# Altium project simple-VCA.PrjPcb
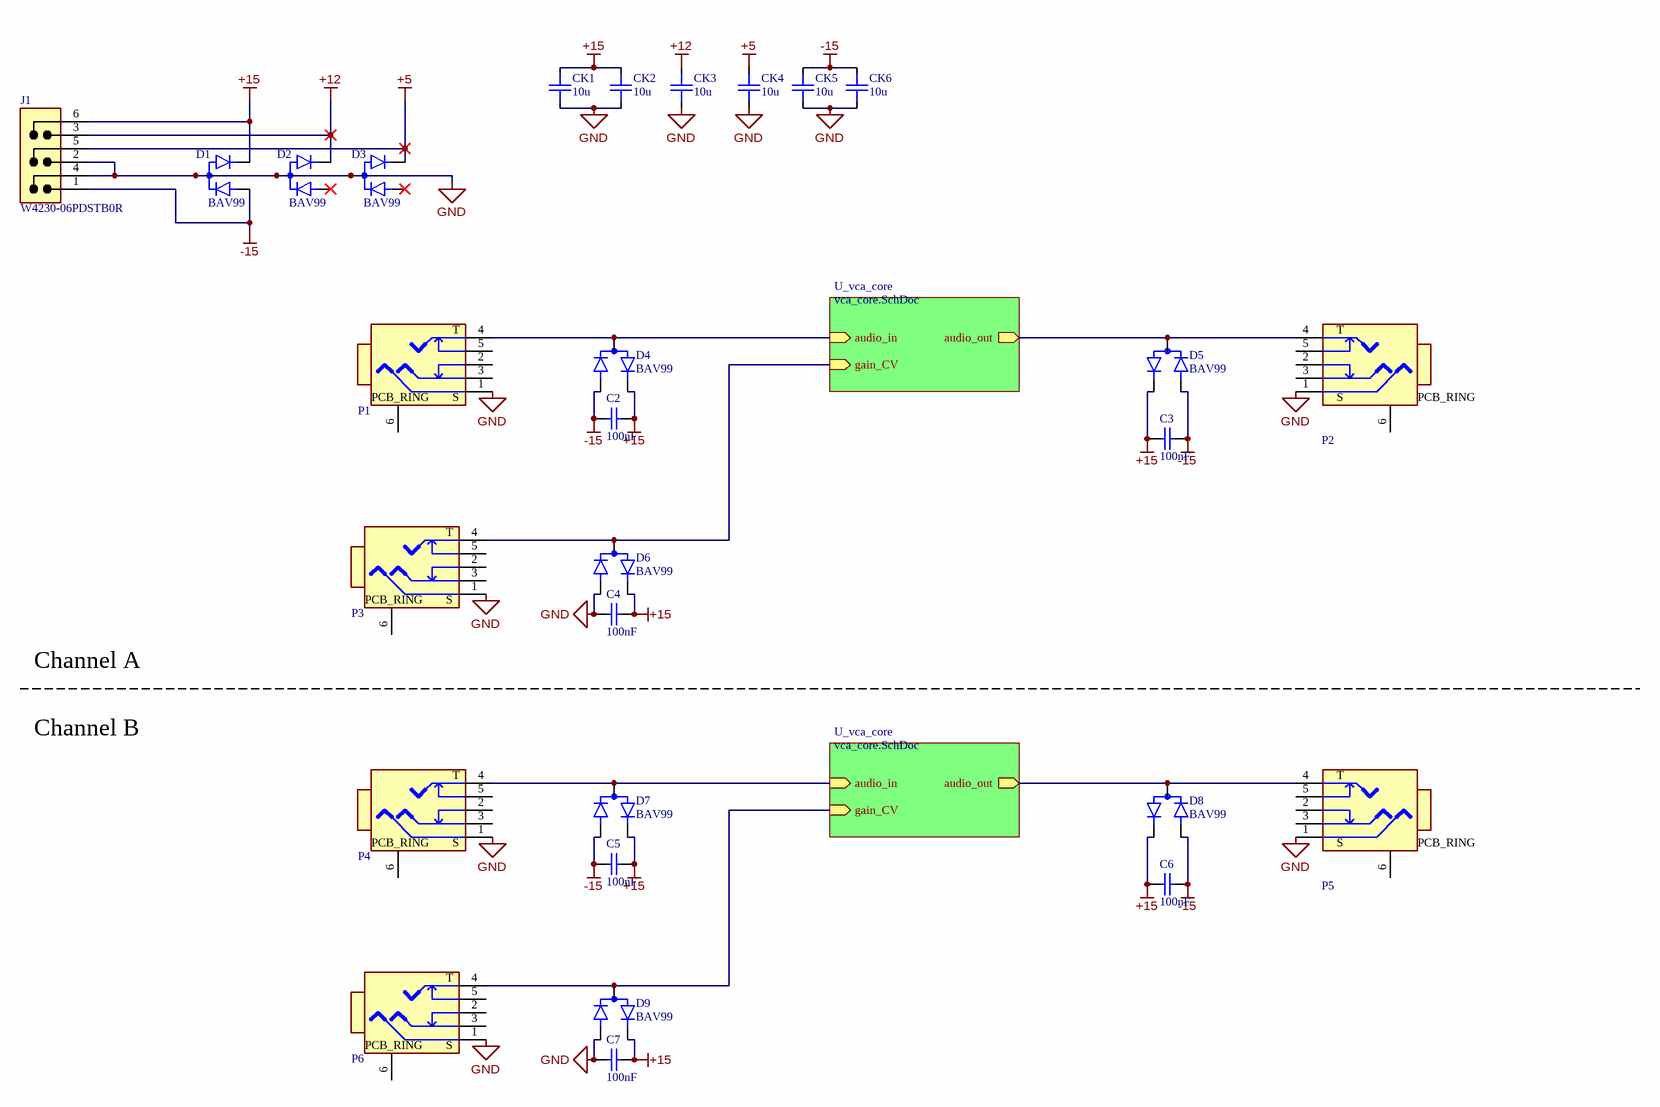
[diagram p0: main.SchDoc]
2 sheets, 98 parts. Net scope: hierarchical (ports join the sheet entries above them; power ports are global).
Board file: simple-VCA.PcbDoc
Sheets:
  main.SchDoc
    U_vca_core = vca_core.SchDoc
    U_vca_core = vca_core.SchDoc

## Sheet main.SchDoc
size A3; Organization: Medical Technologies CZ a.s.; SheetNumber: 1; SheetTotal: 2; Version1: N/A; Version2: N/A; Version3: N/A; Change1description: N/A; Change2description: N/A; Change3description: N/A; Change1DrawnBy: N/A; Change2DrawnBy: N/A; Change3DrawnBy: N/A; Change1CheckedBy: N/A; Change2CheckedBy: N/A; Change3CheckedBy: N/A; PreviusVersion_Chng1: N/A; PreviusVersion_Chng2: N/A; PreviusVersion_Chng3: N/A; Variant1description: Standard assembly; Variant2description: N/A; Variant3description: N/A; Variant4description: N/A; PrimaryCard1: XXXxxxXXX; PrimaryCard2: N/A; PrimaryCard3: N/A; PrimaryCard4: N/A; DocumentName: Docname

### Parts
C2  100nF  [WCAP-CSGP_0603_L1.6W0.8H0.8_Reflow]
C3  100nF  [WCAP-CSGP_0603_L1.6W0.8H0.8_Reflow]
C4  100nF  [WCAP-CSGP_0603_L1.6W0.8H0.8_Reflow]
C5  100nF  [WCAP-CSGP_0603_L1.6W0.8H0.8_Reflow]
C6  100nF  [WCAP-CSGP_0603_L1.6W0.8H0.8_Reflow]
C7  100nF  [WCAP-CSGP_0603_L1.6W0.8H0.8_Reflow]
CK1  10u  [CAPC3225X27N(SMC1210)]
CK2  10u  [CAPC3225X27N(SMC1210)]
CK3  10u  [CAPC3225X27N(SMC1210)]
CK4  10u  [CAPC3225X27N(SMC1210)]
CK5  10u  [CAPC3225X27N(SMC1210)]
CK6  10u  [CAPC3225X27N(SMC1210)]
D1  BAV99  [SOT95P230X110-3N(SOT23)]
D2  BAV99  [SOT95P230X110-3N(SOT23)]
D3  BAV99  [SOT95P230X110-3N(SOT23)]
D4  BAV99  [SOT95P230X110-3N(SOT23)]
D5  BAV99  [SOT95P230X110-3N(SOT23)]
D6  BAV99  [SOT95P230X110-3N(SOT23)]
D7  BAV99  [SOT95P230X110-3N(SOT23)]
D8  BAV99  [SOT95P230X110-3N(SOT23)]
D9  BAV99  [SOT95P230X110-3N(SOT23)]
J1  W4230-06PDSTB0R  [W4230-06PDS]
P1  NYS232  [NYS232]  (value not drawn)
P2  NYS232  [NYS232]  (value not drawn)
P3  NYS232  [NYS232]  (value not drawn)
P4  NYS232  [NYS232]  (value not drawn)
P5  NYS232  [NYS232]  (value not drawn)
P6  NYS232  [NYS232]  (value not drawn)

### Sub-sheets
U_vca_core = vca_core.SchDoc: audio_in (in), gain_CV (in), audio_out (out)
U_vca_core = vca_core.SchDoc: audio_in (in), gain_CV (in), audio_out (out)

### Nets
+5: CK4.1 D3.2(C2) J1.5
+12: CK3.1 D2.2(C2) J1.3
+15: C2.2 C3.2 C4.2 C5.2 C6.2 C7.2 CK1.1 CK2.1 D1.2(C2) D4.2(C2) D5.2(C2) D6.2(C2) D7.2(C2) D8.2(C2) D9.2(C2) J1.6
-15: C2.1 C3.1 C5.1 C6.1 CK5.1 CK6.1 D1.1(A1) D4.1(A1) D5.1(A1) D7.1(A1) D8.1(A1) J1.1
GND: C4.1 C7.1 CK1.2 CK2.2 CK3.2 CK4.2 CK5.2 CK6.2 D1.3(C1A2) D2.3(C1A2) D3.3(C1A2) D6.1(A1) D9.1(A1) J1.2 J1.4 P1.1(S) P2.1(S) P3.1(S) P4.1(S) P5.1(S) P6.1(S)
NetD4_3: D4.3(C1A2) P1.4(TN) ; sheet U_vca_core/audio_in
NetD5_3: D5.3(C1A2) P2.4(TN) ; sheet U_vca_core/audio_out
NetD6_3: D6.3(C1A2) P3.4(TN) ; sheet U_vca_core/gain_CV
NetD7_3: D7.3(C1A2) P4.4(TN) ; sheet U_vca_core/audio_in
NetD8_3: D8.3(C1A2) P5.4(TN) ; sheet U_vca_core/audio_out
NetD9_3: D9.3(C1A2) P6.4(TN) ; sheet U_vca_core/gain_CV

Not connected (* = marked no-connect by the designer): D2 1(A1)*; D3 1(A1)*; P1 2(RN) 3(R) 5(T) 6(PCB_RING); P2 2(RN) 3(R) 5(T) 6(PCB_RING); P3 2(RN) 3(R) 5(T) 6(PCB_RING); P4 2(RN) 3(R) 5(T) 6(PCB_RING); P5 2(RN) 3(R) 5(T) 6(PCB_RING); P6 2(RN) 3(R) 5(T) 6(PCB_RING)

### Notes on the sheet
- Channel A
- Channel B
- Číslo výkresu /drawing number/:
- Nazev listu/sheet name/:
- DPS projekt/PCB project/:
- Kreslil /drawn by/ :
- Kontroloval /checked by/:
- Datum /date/:
- List /sheet/:
- /
- (in symbol NYS232) PCB_RING

### Library data of the parts
C2-C7 = 885012206095: WCAP-CSGP Multilayer Ceramic Chip Capacitor, General Purpose, size 0603, X7R, 100nF, 50V; Manufacturer: Wurth Elektronik; Capacitance Tolerance: +/-10%; Dissipation Factor: 3%; Isolation Resistance: 5GOhm; Technical Reference: X7R0603104K050DFCT10000; Capacitance: 100nF; Ceramic Type: X7R; ComponentLink1Description: Manufacturer Link; ComponentLink1URL: http://www.we-online.de; ComponentLink2Description: Datasheet; ComponentLink2URL: https://www.we-online.com/catalog/datasheet/885012206095.pdf; Height: 0.8mm; Length: 1.6mm; Manufacturer Part Number: 885012206095; Mounting Technology: SMT; Operating Temperature max.: 125C; Operating Temperature min.: -55C; Packaging: Tape and Reel; Rated Voltage: 50V; Size: 0603; Width: 0.8mm
CK1-CK6 = ECK+10U50VXX0: C; 10u; 50V; 10%; X7R; ??;; Manufacturer: Murata: GRM32ER71H106KA12L;;Samsung Electro-mechanics: CL32B106KBJNNNE; Note: X7R, 9uF @ 10V, 5uF @ 30V, 2.5uF @ 50V; Component_Class: Capacitor; Status_I: Production; Status_II: Active; Tolerance_Pct: 10; Voltage_Rating_V: 50; Capacitance_F: 1E-5; KK: ECK+10U50VXX0; Value: 10u; SMD: 1; ComponentLink2URL: I:\DataSheets\ECK+10U50VXX0_MurataEN100.pdf; ComponentLink2Description: ECK+10U50VXX0_MurataEN100.pdf; ComponentLink3URL: I:\DataSheets\ECK+10U50VXX0_SamsungEN100.pdf; ComponentLink3Description: ECK+10U50VXX0_SamsungEN100.pdf; Dielectric_Type: X7R; ComponentLink1URL: heliosgreen://v1/hegMT/5-MT/Classes(343)/Folders/OpenForm?RecordNumbers=[10658879]; ComponentLink1Description: Helios
J1 = EJ-W4230-06PDSTB0RXX0: Con; Micro Fit 3.0; 6x; PCB; Straight; 250V; 5A; Male; Tin; ??;; Manufacturer: HSUAN MAO: W4230-06PDSTB0R;;HSUAN MAO: W4230-06PDSTB0N;;HSM: W4230-06PDSTB0R;;HSM: W4230-06PDSTB0N; Component_Class: Connector; Status_I: Production; Status_II: Active; Multiplicity: 6; Voltage_Rating_V: 250; Current_Rating_A: 5; KK: EJ-W4230-06PDSTB0RXX0; Value: W4230-06PDSTB0R; SMD: 0; ComponentLink2URL: i:\datasheets\EJ-W4230-XXPDSXB0RXX0_HsuanMao.pdf; ComponentLink2Description: EJ-W4230-XXPDSXB0RXX0_HsuanMao.pdf; ComponentLink3URL: I:\datasheets\EJ-W4230-XXPDSTB0NXX0_HsuanMaoEN100.pdf; ComponentLink3Description: EJ-W4230-XXPDSTB0NXX0_HsuanMaoEN100.pdf; Mounting_Style: PCB; Connector_Family: Micro Fit 3.0; Angle: Straight; Gender: Male; Plating: Tin; ComponentLink1URL: heliosgreen://v1/hegMT/5-MT/Classes(343)/Folders/OpenForm?RecordNumbers=[6765380]; ComponentLink1Description: Helios; System: Connector
P1-P6 = NYS232: 6.3 mm jack, right angle, THT
D1-D9 = BAV99: ComponentLink1Description: New link; ComponentLink1URL: C:\Users\Public\Documents\Altium\DSH\EDD+BAV99XX0_OnsemiEN100.PDF

## Sheet vca_core.SchDoc
size A3; Organization: Medical Technologies CZ a.s.; SheetNumber: 2; SheetTotal: 2; Version1: N/A; Version2: N/A; Version3: N/A; Change1description: N/A; Change2description: N/A; Change3description: N/A; Change1DrawnBy: N/A; Change2DrawnBy: N/A; Change3DrawnBy: N/A; Change1CheckedBy: N/A; Change2CheckedBy: N/A; Change3CheckedBy: N/A; PreviusVersion_Chng1: N/A; PreviusVersion_Chng2: N/A; PreviusVersion_Chng3: N/A; Variant1description: Standard assembly; Variant2description: N/A; Variant3description: N/A; Variant4description: N/A; PrimaryCard1: XXXxxxXXX; PrimaryCard2: N/A; PrimaryCard3: N/A; PrimaryCard4: N/A; SPICEModelCacheKGRFIIXE: <root> / <DocumentId>KGRFIIXE</DocumentId> / <CacheFrame Number="0"> / <Model Name="vccs_ext_lim_opa197" Kind="CKT"> / <Text>* / .subckt VCCS_EXT_LIM_OPA197 VIN+ VIN- IOUT- IOUT+ VP+ VP- / .param Gain = 1 / G1 IOUT+ IOUT- VALUE={LIMIT(Gain*V(VIN+,VIN-),V(VP-,VIN-), V(VP+,VIN-))} / .ends VCCS_EXT_LIM_OPA197</Text> / </Model> / <Model Name="vos_drift_opa197" Kind="CKT"> / <Text>* / .SUBCKT VOS_DRIFT_OPA197  VOS+ VOS- / .PARAM DC = 1.712E-05 / .PARAM POL = 1 / .PARAM DRIFT = 2.50E-07 / E1 VOS+ VOS- VALUE={DC+POL*DRIFT*(TEMP-27)} / .ENDS</Text> / </Model> / <Model Name="clamp_amp_lo_opa197" Kind="CKT"> / <Text>* / .subckt CLAMP_AMP_LO_OPA197 VC+ VC- VIN COM VO+ VO- / .param G=1 / GVo+ COM Vo+ Value = {IF(V(VIN,COM)&gt;V(VC+,COM),((V(VIN,COM)-V(VC+,COM))*G),0)} / GVo- COM Vo- Value = {IF(V(VIN,COM)&lt;V(VC-,COM),((V(VC-,COM)-V(VIN,COM))*G),0)} / .ends CLAMP_AMP_LO_OPA197</Text> / </Model> / <Model Name="vccs_lim_iq_opa197" Kind="CKT"> / <Text>* / .subckt VCCS_LIM_IQ_OPA197 VC+ VC- IOUT+ IOUT- / .param Gain = 1e-3 / G1 IOUT+ IOUT- VALUE={IF( (V(VC+,VC-)&lt;=0),0,Gain*V(VC+,VC-) )} / .ends VCCS_LIM_IQ_OPA197</Text> / </Model> / <Model Name="vccs_lim_clawp_opa197" Kind="CKT"> / <Text>* / .subckt VCCS_LIM_CLAWp_OPA197 VC+ VC- IOUT+ IOUT- / G1 IOUT+ IOUT- TABLE {(V(VC+,VC-))} = / +(0, 8.15e-6) / +(31.9, 1.41e-3) / +(44.7, 2.13e-3) / +(57.1, 3.04e-3) / +(63.8, 3.76e-3) / +(66.5, 4.23e-3) / +(67.7, 4.54e-3) / +(68.9, 1.77e-2) / .ends VCCS_LIM_CLAWp_OPA197</Text> / </Model> / <Model Name="vccs_lim_clawn_opa197" Kind="CKT"> / <Text>* / .subckt VCCS_LIM_CLAWn_OPA197 VC+ VC- IOUT+ IOUT- / G1 IOUT+ IOUT- TABLE {(V(VC+,VC-))} = / +(0, 8.23e-6) / +(15.9, 6.9e-4) / +(63.8, 3.18e-3) / +(67.7, 3.54e-3) / +(68.9, 1.8e-2) / .ends VCCS_LIM_CLAWn_OPA197</Text> / </Model> / <Model Name="ol_sense_opa197" Kind="CKT"> / <Text>* / .subckt OL_SENSE_OPA197 1   2  3  4 / GSW+ 1 2 Value = {IF((V(3,1)&gt;10e-3 | V(4,1)&gt;10e-3),1,0)} / .ends OL_SENSE_OPA197</Text> / </Model> / <Model Name="vccs_lim_4_opa197" Kind="CKT"> / <Text>* / .subckt VCCS_LIM_4_OPA197 VC+ VC- IOUT+ IOUT- / .param Gain = 1 / .param Ipos = 1.044 / .param Ineg = -1.044 / G1 IOUT+ IOUT- VALUE={LIMIT(Gain*V(VC+,VC-),Ineg,Ipos)} / .ends VCCS_LIM_4_OPA197</Text> / </Model> / <Model Name="vccs_lim_3_opa197" Kind="CKT"> / <Text>* / .subckt VCCS_LIM_3_OPA197 VC+ VC- IOUT+ IOUT- / .param Gain = 1 / .param Ipos = 0.522 / .param Ineg = -0.522 / G1 IOUT+ IOUT- VALUE={LIMIT(Gain*V(VC+,VC-),Ineg,Ipos)} / .ends VCCS_LIM_3_OPA197</Text> / </Model> / <Model Name="clamp_amp_hi_opa197" Kind="CKT"> / <Text>* / .subckt CLAMP_AMP_HI_OPA197 VC+ VC- VIN COM VO+ VO- / .param G=10 / GVo+ COM Vo+ Value = {IF(V(VIN,COM)&gt;V(VC+,COM),((V(VIN,COM)-V(VC+,COM))*G),0)} / GVo- COM Vo- Value = {IF(V(VIN,COM)&lt;V(VC-,COM),((V(VC-,COM)-V(VIN,COM))*G),0)} / .ends CLAMP_AMP_HI_OPA197</Text> / </Model> / <Model Name="vccs_lim_gr_opa197" Kind="CKT"> / <Text>* / .subckt VCCS_LIM_GR_OPA197 VC+ VC- IOUT+ IOUT- / .param Gain = 1 / .param Ipos = 4.8 / .param Ineg = -4.8 / G1 IOUT+ IOUT- VALUE={LIMIT(Gain*V(VC+,VC-),Ineg,Ipos)} / .ends VCCS_LIM_GR_OPA197</Text> / </Model> / <Model Name="vnse_opa197" Kind="CKT"> / <Text>* / .subckt VNSE_OPA197 1 2 / .param FLW=0.1 / .param GLF=0.1352 / .param RNV=35.8 / .model DVN D KF={PWR(FLW,0.5)/1E11} IS=1.0E-16 / I1 0 7 10E-3 / I2 0 8 10E-3 / D1 7 0 DVN / D2 8 0 DVN / E1 3 6 7 8 {GLF} / R1 3 0 1E9 / R2 3 0 1E9 / R3 3 6 1E9 / E2 6 4 5 0 10 / R4 5 0 {RNV} / R5 5 0 {RNV} / R6 3 4 1E9 / R7 4 0 1E9 / E3 1 2 3 4 1 / .ends VNSE_OPA197</Text> / </Model> / <Model Name="vccs_lim_zo_opa197" Kind="CKT"> / <Text>* / .subckt VCCS_LIM_ZO_OPA197 VC+ VC- IOUT+ IOUT- / .param Gain = 66667 / .param Ipos = 2.11e4 / .param Ineg = -2.11e4 / G1 IOUT+ IOUT- VALUE={LIMIT(Gain*V(VC+,VC-),Ineg,Ipos)} / .ends VCCS_LIM_ZO_OPA197</Text> / </Model> / <Model Name="femt_opa197" Kind="CKT"> / <Text>* / .subckt FEMT_OPA197 1 2 / .param NVRF=1.5 / .param RNVF={1.184*PWR(NVRF,2)} / E1 3 0 5 0 10 / R1 5 0 {RNVF} / R2 5 0 {RNVF} / G1 1 2 3 0 1e-6 / .ends FEMT_OPA197</Text> / </Model> / <Model Name="vccs_lim_1_opa197" Kind="CKT"> / <Text>* / .subckt VCCS_LIM_1_OPA197 VC+ VC- IOUT+ IOUT- / .param Gain = 1e-4 / .param Ipos = .5 / .param Ineg = -.5 / G1 IOUT+ IOUT- VALUE={LIMIT(Gain*V(VC+,VC-),Ineg,Ipos)} / .ends VCCS_LIM_1_OPA197</Text> / </Model> / <Model Name="vccs_lim_2_opa197" Kind="CKT"> / <Text>* / .subckt VCCS_LIM_2_OPA197 VC+ VC- IOUT+ IOUT- / .param Gain = 74.5e-3 / .param Ipos = 2.4 / .param Ineg = -2.4 / G1 IOUT+ IOUT- VALUE={LIMIT(Gain*V(VC+,VC-),Ineg,Ipos)} / .ends VCCS_LIM_2_OPA197</Text> / </Model> / <Model Name="opa197" Kind="CKT"> / <Text>*$ / * OPA197 / ***************************************************************************** / * (C) Copyright 2019 Texas Instruments Incorporated. All rights reserved. / ***************************************************************************** / ** This model is designed as an aid for customers of Texas Instruments. / ** TI and its licensors and suppliers make no warranties, either expressed / ** or implied, with respect to this model, including the warranties of / ** merchantability or fitness for a particular purpose.  The model is / ** provided solely on an "as is" basis.  The entire risk as to its quality / ** and performance is with the customer / ***************************************************************************** / * / * This model is subject to change without notice. Texas Instruments / * Incorporated is not responsible for updating this model. / * / ***************************************************************************** / * / ** Released by: Online Design Tools, Texas Instruments Inc. / * Part: OPA197 / * Date: 30JAN2019 / * Model Type: Generic (suitable for all analysis types) / * EVM Order Number: N/A / * EVM Users Guide:  N/A / * Datasheet: SBOS737C â€“JANUARY 2016â€“REVISED MARCH 2018 / * Created with Green-Williams-Lis Op Amp Macro-model Architecture / * / * Model Version: Final 1.1 / * / ***************************************************************************** / * / * Final 1.1 / * Updated with unique subckt name, Vos drift, Current Noise and edits in claw block / * / * Final 1.0 / * Release to Web. / * / ***************************************************************************** / * Model Usage Notes: / * 1. The following parameters are modeled: / * 		OPEN-LOOP GAIN AND PHASE VS. FREQUENCY  WITH RL, CL EFFECTS (Aol) / * 		UNITY GAIN BANDWIDTH (GBW) / * 		INPUT COMMON-MODE REJECTION RATIO VS. FREQUENCY (CMRR) / * 		POWER SUPPLY REJECTION RATIO VS. FREQUENCY (PSRR) / * 		DIFFERENTIAL INPUT IMPEDANCE (Zid) / * 		COMMON-MODE INPUT IMPEDANCE (Zic) / * 		OPEN-LOOP OUTPUT IMPEDANCE VS. FREQUENCY (Zo) / * 		OUTPUT CURRENT THROUGH THE SUPPLY (Iout) / * 		INPUT VOLTAGE NOISE DENSITY VS. FREQUENCY (en) / * 		INPUT CURRENT NOISE DENSITY VS. FREQUENCY (in) / * 		OUTPUT VOLTAGE SWING vs. OUTPUT CURRENT (Vo) / * 		SHORT-CIRCUIT OUTPUT CURRENT (Isc) / * 		QUIESCENT CURRENT (Iq) / * 		SETTLING TIME VS. CAPACITIVE LOAD (ts) / * 		SLEW RATE (SR) / * 		SMALL SIGNAL OVERSHOOT VS. CAPACITIVE LOAD / * 		LARGE SIGNAL RESPONSE / * 		OVERLOAD RECOVERY TIME (tor) / * 		INPUT BIAS CURRENT (Ib) / * 		INPUT OFFSET CURRENT (Ios) / * 		INPUT OFFSET VOLTAGE (Vos) / * 		INPUT OFFSET VOLTAGE VS. TEMPERATURE (VOS DRIFT) / * 		INPUT COMMON-MODE VOLTAGE RANGE (Vcm) / * 		INPUT OFFSET VOLTAGE VS. INPUT COMMON-MODE VOLTAGE (Vos vs. Vcm) / * 		INPUT/OUTPUT ESD CELLS (ESDin, ESDout) / ****************************************************** / .subckt OPA197 IN+ IN- VCC VEE OUT / ****************************************************** / * MODEL DEFINITIONS: / .model ESD_SW VSWITCH(Ron=50 Roff=1e12 Von=700e-3 Voff=100e-3) / .model OL_SW VSWITCH(Ron=1e-3 Roff=1e9 Von=900e-3 Voff=800e-3) / .model OR_SW VSWITCH(Ron=10e-3 Roff=1e9 Von=10e-3 Voff=0) / .model R_NOISELESS RES(T_ABS=-273.15) / ****************************************************** / XV_OS N035 N041 VOS_DRIFT_OPA197 / R1 N038 N036 R_NOISELESS 1e-3 / R2 N047 ESDn R_NOISELESS 1e-3 / R3 N059 0 R_NOISELESS 1e12 / C1 N059 0 1 / R4 VCC_B N058 R_NOISELESS 1e-3 / C2 N058 0 1e-15 / C3 N060 0 1e-15 / R5 N060 VEE_B R_NOISELESS 1e-3 / G1 N038 N039 N007 N006 1e-3 / R6 MID N045 R_NOISELESS 1e12 / VCM_MIN N046 VEE_B -0.1 / R7 N046 MID R_NOISELESS 1e12 / VCM_MAX N045 VCC_B 0.1 / XVCM_CLAMP N039 MID N042 MID N045 N046 VCCS_EXT_LIM_OPA197 / R8 N042 MID R_NOISELESS 1 / C4 N043 MID 1e-15 / R9 N042 N043 R_NOISELESS 1e-3 / V4 N056 OUT 0 / R10 MID N048 R_NOISELESS 1e12 / R11 MID N049 R_NOISELESS 1e12 / XIQp VIMON MID VCC MID VCCS_LIM_IQ_OPA197 / XIQn MID VIMON MID VEE VCCS_LIM_IQ_OPA197 / R12 VCC_B N012 R_NOISELESS 1e3 / R13 N025 VEE_B R_NOISELESS 1e3 / XCLAWp VIMON MID N012 VCC_B VCCS_LIM_CLAWp_OPA197 / XCLAWn MID VIMON VEE_B N025 VCCS_LIM_CLAWn_OPA197 / R14 VEE_CLP MID R_NOISELESS 1e3 / R15 MID VCC_CLP R_NOISELESS 1e3 / R16 N013 N012 R_NOISELESS 1e-3 / R17 N026 N025 R_NOISELESS 1e-3 / C5 MID N013 1e-15 / C6 N026 MID 1e-15 / R18 VOUT_S N049 R_NOISELESS 100 / C7 VOUT_S MID 1e-12 / G2 MID VCC_CLP N013 MID 1e-3 / G3 MID VEE_CLP N026 MID 1e-3 / XCL_AMP N010 N037 VIMON MID N016 N023 CLAMP_AMP_LO_OPA197 / V_ISCp N010 MID 65 / V_ISCn N037 MID -65 / XOL_SENSE_OPA197 MID N063 N062 N065 OL_SENSE_OPA197 / R19 N037 MID R_NOISELESS 1e12 / R20 N023 MID R_NOISELESS 1 / C8 N024 MID 1e-15 / R21 MID N016 R_NOISELESS 1 / R22 MID N010 R_NOISELESS 1e12 / C9 MID N017 1e-15 / XCLAW_AMP VCC_CLP VEE_CLP VOUT_S MID N014 N021 CLAMP_AMP_LO_OPA197 / R23 VEE_CLP MID R_NOISELESS 1e12 / R24 N021 MID R_NOISELESS 1 / C10 N022 MID 1e-15 / R25 MID N014 R_NOISELESS 1 / R26 MID VCC_CLP R_NOISELESS 1e12 / C11 MID N015 1e-15 / XCL_SRC N017 N024 CL_CLAMP MID VCCS_LIM_4_OPA197 / XCLAW_SRC N015 N022 CLAW_CLAMP MID VCCS_LIM_3_OPA197 / R27 N014 N015 R_NOISELESS 1e-3 / R28 N022 N021 R_NOISELESS 1e-3 / R29 N016 N017 R_NOISELESS 1e-3 / R30 N024 N023 R_NOISELESS 1e-3 / R31 N063 MID R_NOISELESS 1 / R32 N063 SW_OL R_NOISELESS 100 / C12 SW_OL MID 1e-12 / R33 VIMON N048 R_NOISELESS 100 / C13 VIMON MID 1e-12 / C_DIFF ESDp ESDn 1.6e-12 / C_CMn ESDn MID 6.4e-12 / C_CMp MID ESDp 6.4e-12 / I_Q VCC VEE 1e-3 / I_B N041 MID 5e-12 / I_OS ESDn MID 3e-12 / R34 IN+ ESDp R_NOISELESS 100 / R35 IN- ESDn R_NOISELESS 100 / R36 N033 MID R_NOISELESS 1 / R37 N040 MID R_NOISELESS 1e12 / R38 MID N019 R_NOISELESS 1 / R39 MID N011 R_NOISELESS 1e12 / XGR_AMP N011 N040 N018 MID N019 N033 CLAMP_AMP_HI_OPA197 / XGR_SRC N020 N034 CLAMP MID VCCS_LIM_GR_OPA197 / C17 MID N020 1e-15 / C18 N034 MID 1e-15 / V_GRn N040 MID -251 / V_GRp N011 MID 251 / R40 N019 N020 R_NOISELESS 1e-3 / R41 N034 N033 R_NOISELESS 1e-3 / R42 VSENSE N018 R_NOISELESS 1e-3 / C19 MID N018 1e-15 / R43 MID VSENSE R_NOISELESS 1e3 / G5 N035 N036 N009 MID 1e-3 / G8 MID CLAW_CLAMP N050 MID 1e-3 / R45 MID CLAW_CLAMP R_NOISELESS 1e3 / G9 MID CL_CLAMP CLAW_CLAMP MID 1e-3 / R46 MID CL_CLAMP R_NOISELESS 1e3 / R47 N057 VCLP R_NOISELESS 100 / C24 MID VCLP 1e-12 / E4 N057 MID CL_CLAMP MID 1 / E5 N049 MID OUT MID 1 / H1 N048 MID V4 1e3 / S1 N052 N051 SW_OL MID OL_SW / R52 MID ESDp R_NOISELESS 1e12 / R53 ESDn MID R_NOISELESS 1e12 / R58 N036 N035 R_NOISELESS 1e3 / R59 N058 N059 R_NOISELESS 1e6 / R60 N059 N060 R_NOISELESS 1e6 / R67 N039 N038 R_NOISELESS 1e3 / G15 MID VSENSE CLAMP MID 1e-3 / V_ORp N032 VCLP 4 / V_ORn N027 VCLP -4 / V11 N029 N028 0 / V12 N030 N031 0 / H2 N061 MID V11 -1 / H3 N064 MID V12 1 / S2 VCC ESDn ESDn VCC ESD_SW / S3 VCC ESDp ESDp VCC ESD_SW / S4 ESDn VEE VEE ESDn ESD_SW / S5 ESDp VEE VEE ESDp ESD_SW / S6 VCC OUT OUT VCC ESD_SW / S7 OUT VEE VEE OUT ESD_SW / E1 MID 0 N059 0 1 / G16 0 VCC_B VCC 0 1 / G17 0 VEE_B VEE 0 1 / R88 VCC_B 0 R_NOISELESS 1 / R89 VEE_B 0 R_NOISELESS 1 / S8 N030 CLAMP CLAMP N030 OR_SW / S9 CLAMP N029 N029 CLAMP OR_SW / Xe_n ESDp N041 VNSE_OPA197 / Xi_nn ESDn MID FEMT_OPA197 / Xi_np N041 MID FEMT_OPA197 / XVCCS_LIMIT_1 N043 N047 MID N044 VCCS_LIM_1_OPA197 / XVCCS_LIMIT_2 N044 MID MID CLAMP VCCS_LIM_2_OPA197 / R44 N044 MID R_NOISELESS 1e6 / R68 CLAMP MID R_NOISELESS 1e6 / G7 MID N050 VSENSE MID 1e-6 / R69 N050 MID R_NOISELESS 1e6 / R72 N062 N061 R_NOISELESS 100 / R75 N064 N065 R_NOISELESS 100 / C27 N062 MID 1e-9 / C28 N065 MID 1e-9 / XVCCS_LIM_ZO_OPA197 N054 MID MID N055 VCCS_LIM_ZO_OPA197 / C15 N007 N008 4.97e-10 / R54 N007 MID R_NOISELESS 320 / R55 N007 N008 R_NOISELESS 1e8 / G13 MID N008 VCC_B MID 68.4e-3 / Rsrc4 N008 MID R_NOISELESS 1 / C16 N006 N005 4.97e-10 / R56 N006 MID R_NOISELESS 320 / R57 N006 N005 R_NOISELESS 1e8 / G14 MID N005 VEE_B MID 68.4e-3 / Rsrc2 N005 MID R_NOISELESS 1 / Rx N056 N055 R_NOISELESS 3.25e5 / Rdummy N056 MID R_NOISELESS 3.25e4 / G4 MID N051 CL_CLAMP N056 90.91 / Rdc1 N051 MID R_NOISELESS 1 / R51 N051 N052 R_NOISELESS 1e4 / R64 N052 MID R_NOISELESS 1184.21 / G6 MID N053 N052 MID 9.44 / C23 N052 N051 1.77e-5 / R65 N053 N054 R_NOISELESS 1e4 / R66 N054 MID R_NOISELESS 0.15 / C26 N054 N053 1.06e-11 / R70 N055 MID R_NOISELESS 1 / R71 N053 MID R_NOISELESS 1 / C21 CLAMP MID 1.13e-7 / C29 N050 MID 7e-15 / C20 N002 N001 7.234e-10 / R50 N002 MID R_NOISELESS 2.2 / R61 N002 N001 R_NOISELESS 1e4 / G_adjust1 MID N001 ESDp MID 454e-6 / Rsrc3 N001 MID R_NOISELESS 1 / G18 MID N003 MID N002 1 / Rsrc5 N003 MID R_NOISELESS 1 / C22 N004 N003 7.234e-10 / R62 N004 N003 R_NOISELESS 1e4 / R63 N004 MID R_NOISELESS 2.2 / G19 MID N009 MID N004 4545.45 / Rsrc6 N009 MID R_NOISELESS 1 / G10 MID N028 N027 MID 1 / G11 MID N031 N032 MID 1 / R48 N028 MID R_NOISELESS 1 / R49 N031 MID R_NOISELESS 1 / .ends OPA197</Text> / <Dependency>0\vccs_ext_lim_opa197</Dependency> / <Dependency>0\vos_drift_opa197</Dependency> / <Dependency>0\clamp_amp_lo_opa197</Dependency> / <Dependency>0\vccs_lim_iq_opa197</Dependency> / <Dependency>0\vccs_lim_clawp_opa197</Dependency> / <Dependency>0\vccs_lim_clawn_opa197</Dependency> / <Dependency>0\ol_sense_opa197</Dependency> / <Dependency>0\vccs_lim_4_opa197</Dependency> / <Dependency>0\vccs_lim_3_opa197</Dependency> / <Dependency>0\clamp_amp_hi_opa197</Dependency> / <Dependency>0\vccs_lim_gr_opa197</Dependency> / <Dependency>0\vnse_opa197</Dependency> / <Dependency>0\vccs_lim_zo_opa197</Dependency> / <Dependency>0\femt_opa197</Dependency> / <Dependency>0\vccs_lim_1_opa197</Dependency> / <Dependency>0\vccs_lim_2_opa197</Dependency> / </Model> / <Model Name="opa197full" Kind="CKT"> / <Text>.SUBCKT OPA197FULL    O1 I1M I1P VCC I2P I2M O2 O3 I3M I3P GND I4P I4M O4 / X1 I1P I1M VCC GND O1 OPA197 / X2 I2P I2M VCC GND O2 OPA197 / X3 I3P I3M VCC GND O3 OPA197 / X4 I4P I4M VCC GND O4 OPA197 / .ENDS OPA197FULL</Text> / <Dependency>0\opa197</Dependency> / </Model> / <Model Name="qbc817-40" Kind="MDL"> / <Text>* / ********************************************************** / * / * BC817-40 / * / * NXP Semiconductors / * / * General purpose NPN transistor / * IC   = 500 mA / * VCEO = 45 V / * hFE  = 250 - 600 @ 1V/100mA / * / * / * / * / * Package pinning does not match Spice model pinning. / * Package: SOT 23 / * / * Package Pin 1: Base / * Package Pin 2: Emitter / * Package Pin 3: Collector / * / * / * / * Simulator: Spice 2 / * / ********************************************************** / *# / .MODEL QBC817-40 NPN / +    IS = 6.286E-14 / +    NF = 0.9917 / +    ISE = 4.53E-15 / +    NE = 1.774 / +    BF = 416.3 / +    IKF = 0.4913 / +    VAF = 98.08 / +    NR = 0.9895 / +    ISC = 1.877E-13 / +    NC = 1.3 / +    BR = 24.49 / +    IKR = 0.203 / +    VAR = 25 / +    RB = 1 / +    IRB = 1000 / +    RBM = 1 / +    RE = 0.2256 / +    RC = 0.143 / +    XTB = 0 / +    EG = 1.11 / +    XTI = 3 / +    CJE = 3.568E-11 / +    VJE = 0.726 / +    MJE = 0.3721 / +    TF = 4.826E-10 / +    XTF = 120 / +    VTF = 3.654 / +    ITF = 5.104 / +    PTF = 0 / +    CJC = 1.296E-11 / +    VJC = 0.3241 / +    MJC = 0.3742 / +    XCJC = 0.455 / +    TR = 7E-11 / +    CJS = 0 / +    VJS = 0.75 / +    MJS = 0.333 / +    FC = 0.8662</Text> / </Model> / </CacheFrame> / </root>; DocumentName: Docname
Used 2 times, as channels U_vca_core, U_vca_core. Parts and nets are listed once, with the designators drawn on the sheet.
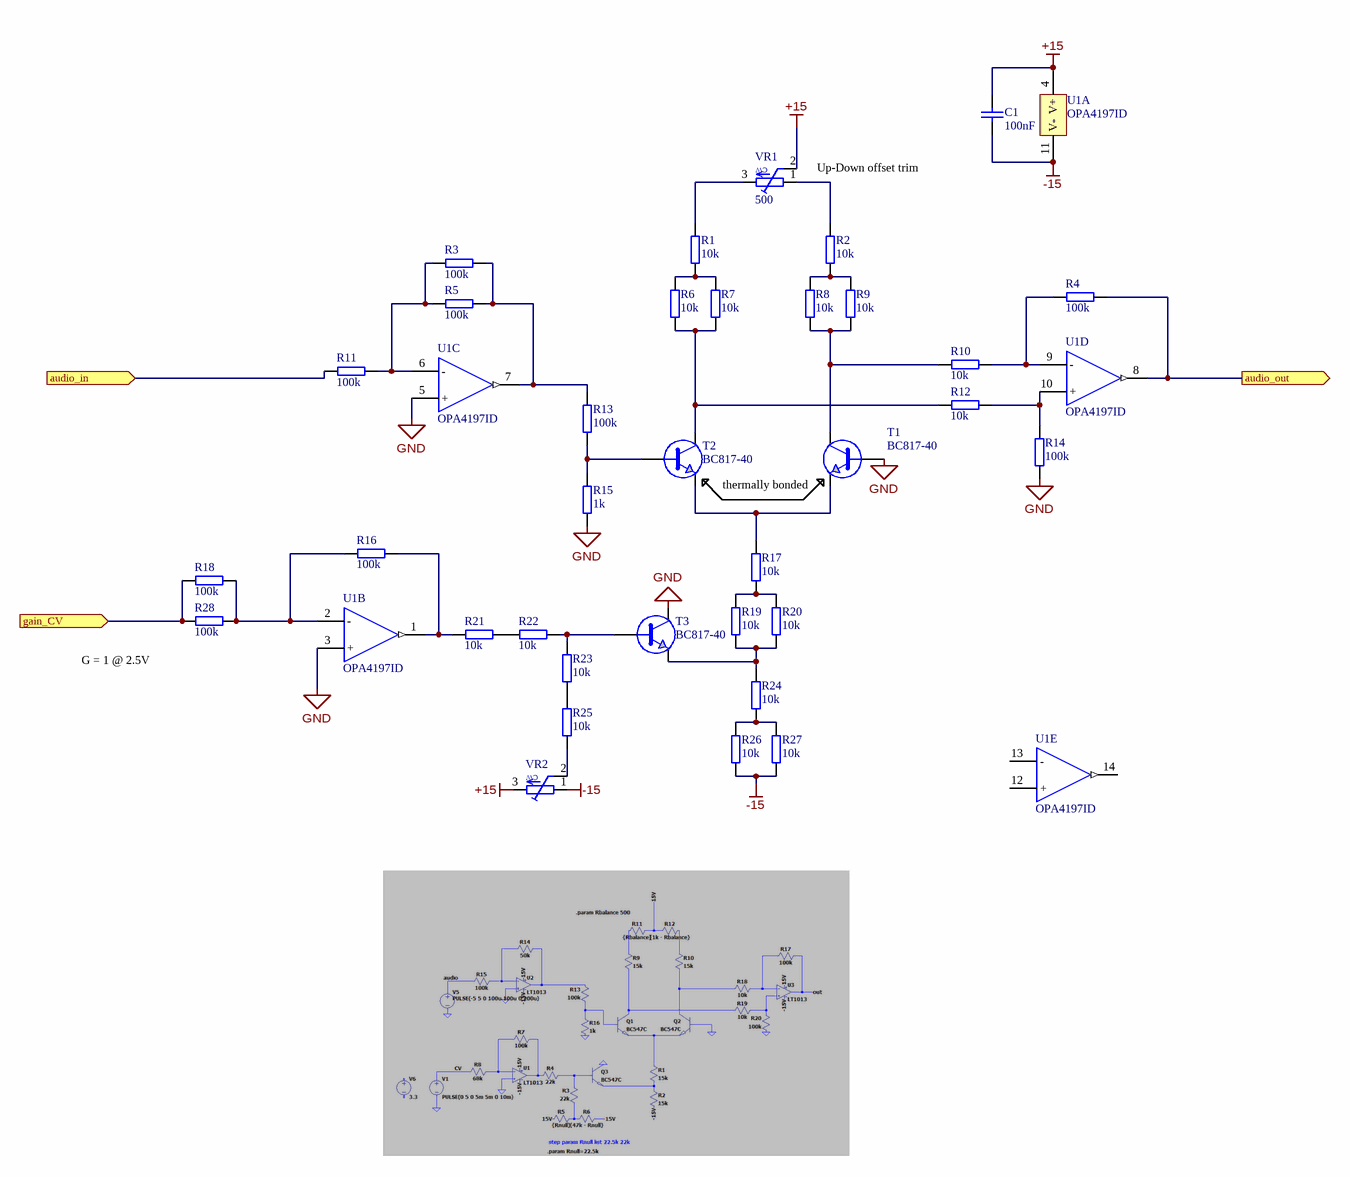
[diagram p1: vca_core.SchDoc]

### Parts
C1  100nF  [WCAP-CSGP_0603_L1.6W0.8H0.8_Reflow]
R1  10k  [RESC1608X06N(SMR0603)]
R2  10k  [RESC1608X06N(SMR0603)]
R3  100k  [RESC1608X06N(SMR0603)]
R4  100k  [RESC1608X06N(SMR0603)]
R5  100k  [RESC1608X06N(SMR0603)]
R6  10k  [RESC1608X06N(SMR0603)]
R7  10k  [RESC1608X06N(SMR0603)]
R8  10k  [RESC1608X06N(SMR0603)]
R9  10k  [RESC1608X06N(SMR0603)]
R10  10k  [RESC1608X06N(SMR0603)]
R11  100k  [RESC1608X06N(SMR0603)]
R12  10k  [RESC1608X06N(SMR0603)]
R13  100k  [RESC1608X06N(SMR0603)]
R14  100k  [RESC1608X06N(SMR0603)]
R15  1k  [RESC1608X06N(SMR0603)]
R16  100k  [RESC1608X06N(SMR0603)]
R17  10k  [RESC1608X06N(SMR0603)]
R18  100k  [RESC1608X06N(SMR0603)]
R19  10k  [RESC1608X06N(SMR0603)]
R20  10k  [RESC1608X06N(SMR0603)]
R21  10k  [RESC1608X06N(SMR0603)]
R22  10k  [RESC1608X06N(SMR0603)]
R23  10k  [RESC1608X06N(SMR0603)]
R24  10k  [RESC1608X06N(SMR0603)]
R25  10k  [RESC1608X06N(SMR0603)]
R26  10k  [RESC1608X06N(SMR0603)]
R27  10k  [RESC1608X06N(SMR0603)]
R28  100k  [RESC1608X06N(SMR0603)]
T1  BC817-40  [SOT95P230X110-3N(SOT23)]
T2  BC817-40  [SOT95P230X110-3N(SOT23)]
T3  BC817-40  [SOT95P230X110-3N(SOT23)]
U1  OPA4197ID  [SOIC127P600X175-14N(SO-14)]  (parts A,B,C,D,E of 5)
VR1  500  [64W]
VR2  (no value)  [64W]

### Ports
audio_in (in), audio_out (out), gain_CV (in)

### Nets
+15: C1.2 U1.4(V+) VR1.2 VR2.3
-15: C1.1 R26.2 R27.2 U1.11(V-) VR2.1
GND: R14.1 R15.2 T1.1(B) T3.3(C) U1.3(+) U1.5(+)
audio_in: R11.1 ; port audio_in
audio_out: R4.1 U1.8(OUT3) ; port audio_out
gain_CV: R18.2 R28.2 ; port gain_CV
NetR1_1: R1.1 VR1.3
NetR1_2: R1.2 R6.1 R7.1
NetR2_1: R2.1 VR1.1
NetR2_2: R2.2 R8.1 R9.1
NetR3_1: R3.1 R5.1 R11.2 U1.6(-)
NetR3_2: R3.2 R5.2 R13.1 U1.7(OUT2)
NetR4_2: R4.2 R10.1 U1.9(-)
NetR6_2: R6.2 R7.2 R12.2 T2.3(C)
NetR8_2: R8.2 R9.2 R10.2 T1.3(C)
NetR12_1: R12.1 R14.2 U1.10(+)
NetR13_2: R13.2 R15.1 T2.1(B)
NetR16_1: R16.1 R21.1 U1.1(OUT1)
NetR16_2: R16.2 R18.1 R28.1 U1.2(-)
NetR17_1: R17.1 T1.2(E) T2.2(E)
NetR17_2: R17.2 R19.1 R20.1
NetR19_2: R19.2 R20.2 R24.1 T3.2(E)
NetR21_2: R21.2 R22.1
NetR22_2: R22.2 R23.1 T3.1(B)
NetR23_2: R23.2 R25.1
NetR24_2: R24.2 R26.1 R27.1
NetR25_2: R25.2 VR2.2

Not connected (* = marked no-connect by the designer): U1 12(+) 13(-) 14(OUT4)

### Channels
U_vca_core: designators end in _U_vca_coreB; ports audio_in=NetD4_3 audio_out=NetD5_3 gain_CV=NetD6_3
U_vca_core: designators end in _U_vca_coreA; ports audio_in=NetD7_3 audio_out=NetD8_3 gain_CV=NetD9_3

### Notes on the sheet
- (near VR1) Up-Down offset trim
- (near T1) thermally bonded
- (near R28) G = 1 @ 2.5V
- Číslo výkresu /drawing number/:
- Nazev listu/sheet name/:
- DPS projekt/PCB project/:
- Kreslil /drawn by/ :
- Kontroloval /checked by/:
- Datum /date/:
- List /sheet/:
- /
- (in symbol Trimmer universal 3/8 (10mm)) CW

### Library data of the parts
C1 = 885012206095: as C2 on sheet main; Capacitance: 100nF; Ceramic Type: X7R; ComponentLink1Description: Manufacturer Link; ComponentLink1URL: http://www.we-online.de; ComponentLink2Description: Datasheet; ComponentLink2URL: https://www.we-online.com/catalog/datasheet/885012206095.pdf; Height: 0.8mm; Length: 1.6mm; Manufacturer Part Number: 885012206095; Mounting Technology: SMT; Operating Temperature max.: 125C; Operating Temperature min.: -55C; Packaging: Tape and Reel; Rated Voltage: 50V; Size: 0603; Width: 0.8mm
R1-R28 = R 0603 universal: Thick Film resistor, 0603 Size, universal value, 0.1 W; Tolerance & Rating: 1%/0.1W; Signal Integrity: Res; consumption: 0; RPP: 0,0188; Package: 0603; Simulation: Res; SMD: 1; ComponentLink1Description: ER+xxxx0.1W0603XXx_YageoEN100.pdf; ComponentLink1URL: i:\DataSheets\ER+xxxx0.1W0603XXx_YageoEN100.pdf; ComponentLink3Description: rezistor čip; ComponentLink3URL: heliosgreen://v1/hegMT/5-MT/Classes(343)/Folders/OpenForm?RecordNumbers=[6094847]
  R1 R2 R6-R10 R12 R17 R19-R27: Value: 10k
  R3-R5 R11 R13 R14 R16 R18 R28: Value: 100k
  R15: Value: 1k
T1-T3 = ET+BC817-40XX0: SSw; NPN; ??Ohm; 45V; 0.5A; 1x;; Manufacturer: NXP: BC817-40,215;;PHILIPS: BC817-40;;INFINEON: BC817-40;;FAI: BC817-40;;STM: BC817-40;;ONS: BC817-40;;NEXPERIA: BC817-40;;NEXPERIA: BC817-40,235; Component_Class: Semiconductor Switch; Status_I: Production; Status_II: Active; Multiplicity: 1; Voltage_Rating_V: 45; Current_Rating_A: 0.5; KK: ET+BC817-40XX0; Value: BC817-40; SMD: 1; ComponentLink2URL: i:\datasheets\ET+BC817-40XX0_Philips (NXP).pdf; ComponentLink2Description: ET+BC817-40XX0_Philips (NXP).pdf; ComponentLink3URL: i:\DataSheets\SMD_parts_pictures\ET+BC817-40XX0-a.jpg; ComponentLink3Description: ET+BC817-40XX0-a.jpg; ComponentLink4URL: I:\datasheets\ET+BC817-40XX0_OnsemiEN100.pdf; ComponentLink4Description: ET+BC817-40XX0_OnsemiEN100.pdf; ComponentLink5URL: I:\datasheets\ET+BC817-40XX0_spec_OnsemiEN100.pdf; ComponentLink5Description: ET+BC817-40XX0_spec_OnsemiEN100.pdf; Semiconductor_Switch_Type: NPN; ComponentLink1URL: heliosgreen://v1/hegMT/5-MT/Classes(343)/Folders/OpenForm?RecordNumbers=[382033]; ComponentLink1Description: Helios
U1 = EU+OPA4197IDRXX0: IC; Opamp; 4.5V; 36V; 4x;; Manufacturer: Texas Instruments: OPA4197IDR; Note: Precision, Rail-to-Rail Input/Output, Low Offset Voltage, Operational Amplifiers; Status_I: Production; Status_II: Active; Multiplicity: 4; Vmin_V: 4.5; Vmax_V: 36; KK: EU+OPA4197IDRXX0; Value: OPA4197ID; Component_Class: IC; SMD: 1; ComponentLink2URL: I:\DataSheets\EU+OPA4197IDRXX0_TexasEN100.pdf; ComponentLink2Description: EU+OPA4197IDRXX0_TexasEN100.pdf; IC_Type: Opamp; ComponentLink1URL: heliosgreen://v1/hegMT/5-MT/Classes(343)/Folders/OpenForm?RecordNumbers=[10961893]; ComponentLink1Description: Helios
VR1 VR2 = Trimmer universal 3/8 (10mm): 093 - 3/8" Square (10 mm) Multi-Turn Cermet Trimmer; KK: ERP-10K0.5WXX0; SMD: 0; ComponentLink1Description: Datasheet
  VR1: Value: 500

## Nets that join several sheets
+15: main (16 pins), U_vca_core (C1_U_vca_coreB.2 U1_U_vca_coreB.4 VR1_U_vca_coreB.2 VR2_U_vca_coreB.3), U_vca_core (C1_U_vca_coreA.2 U1_U_vca_coreA.4 VR1_U_vca_coreA.2 VR2_U_vca_coreA.3)
-15: main (12 pins), U_vca_core (5 pins), U_vca_core (5 pins)
GND: main (21 pins), U_vca_core (6 pins), U_vca_core (6 pins)
NetD4_3: main (D4.3 P1.4), U_vca_core (R11_U_vca_coreB.1)
NetD5_3: main (D5.3 P2.4), U_vca_core (R4_U_vca_coreB.1 U1_U_vca_coreB.8)
NetD6_3: main (D6.3 P3.4), U_vca_core (R18_U_vca_coreB.2 R28_U_vca_coreB.2)
NetD7_3: main (D7.3 P4.4), U_vca_core (R11_U_vca_coreA.1)
NetD8_3: main (D8.3 P5.4), U_vca_core (R4_U_vca_coreA.1 U1_U_vca_coreA.8)
NetD9_3: main (D9.3 P6.4), U_vca_core (R18_U_vca_coreA.2 R28_U_vca_coreA.2)